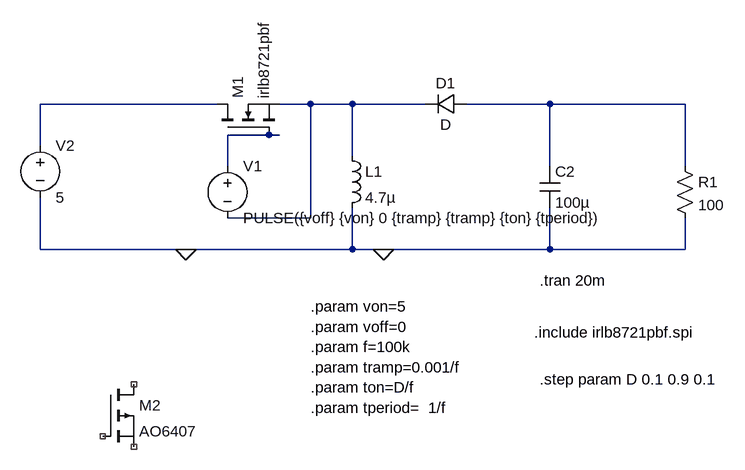
[diagram p0: schematic buck_boost_test_nmos.asc]
buck_boost_test_nmos.asc, the LTspice schematic file:
Version 4
SHEET 1 1244 744
WIRE 160 208 -112 208
WIRE 304 208 256 208
WIRE 368 208 304 208
WIRE 480 208 368 208
WIRE 672 208 544 208
WIRE 880 208 672 208
WIRE 240 256 176 256
WIRE 256 256 240 256
WIRE -112 272 -112 208
WIRE 368 288 368 208
WIRE 176 304 176 256
WIRE 672 304 672 208
WIRE 880 304 880 208
WIRE 304 384 304 208
WIRE 304 384 176 384
WIRE -112 432 -112 352
WIRE 112 432 -112 432
WIRE 368 432 368 368
WIRE 368 432 112 432
WIRE 416 432 368 432
WIRE 672 432 672 368
WIRE 672 432 416 432
WIRE 880 432 880 384
WIRE 880 432 672 432
FLAG 112 432 0
FLAG 416 432 0
SYMBOL Voltage 176 288 R0
SYMATTR InstName V1
SYMATTR Value PULSE({voff} {von} 0 {tramp} {tramp} {ton} {tperiod})
SYMBOL ind 352 272 R0
SYMATTR InstName L1
SYMATTR Value 4.7µ
SYMBOL Diode 544 192 R90
WINDOW 0 0 32 VBottom 2
WINDOW 3 32 32 VTop 2
SYMATTR InstName D1
SYMBOL Cap 656 304 R0
SYMATTR InstName C2
SYMATTR Value 100µ
SYMBOL Res 864 288 R0
SYMATTR InstName R1
SYMATTR Value 100
SYMBOL Voltage -112 256 R0
SYMATTR InstName V2
SYMATTR Value 5
SYMBOL nmos 160 256 R270
SYMATTR InstName M1
SYMATTR Value irlb8721pbf
SYMATTR Prefix X
SYMBOL pmos -16 640 R0
SYMATTR InstName M2
SYMATTR Value AO6407
TEXT 304 520 Left 2 !.param von=5\n.param voff=0\n.param f=100k\n.param tramp=0.001/f\n.param ton=D/f\n.param tperiod=  1/f
TEXT 656 480 Left 2 !.tran 20m
TEXT 648 560 Left 2 !.include irlb8721pbf.spi
TEXT 656 632 Left 2 !.step param D 0.1 0.9 0.1

The netlist it stands for:
* buck_boost_test_nmos.asc
V1 N004 N002 PULSE({voff} {von} 0 {tramp} {tramp} {ton} {tperiod})
L1 N002 0 4.7µ
D1 N003 N002 D
C2 N003 0 100µ
R1 N003 0 100
V2 N001 0 5
XM1 N001 N004 N002 irlb8721pbf  ; pins D G S
M2 NC_01 NC_02 NC_03 NC_03 AO6407
.model D D
.lib standard.dio
.model NMOS NMOS
.model PMOS PMOS
.lib standard.mos
.param von=5
.param voff=0
.param f=100k
.param tramp=0.001/f
.param ton=D/f
.param tperiod=  1/f
.tran 20m
.include irlb8721pbf.spi
.step param D 0.1 0.9 0.1
.backanno
.end